# Altium schematic sheet Fan_Driver.SchDoc: Fan_Driver
size A4; Author: Thomas Carrington; DocumentNumber: 4; Revision: 2.1; SheetNumber: 4; SheetTotal: 8
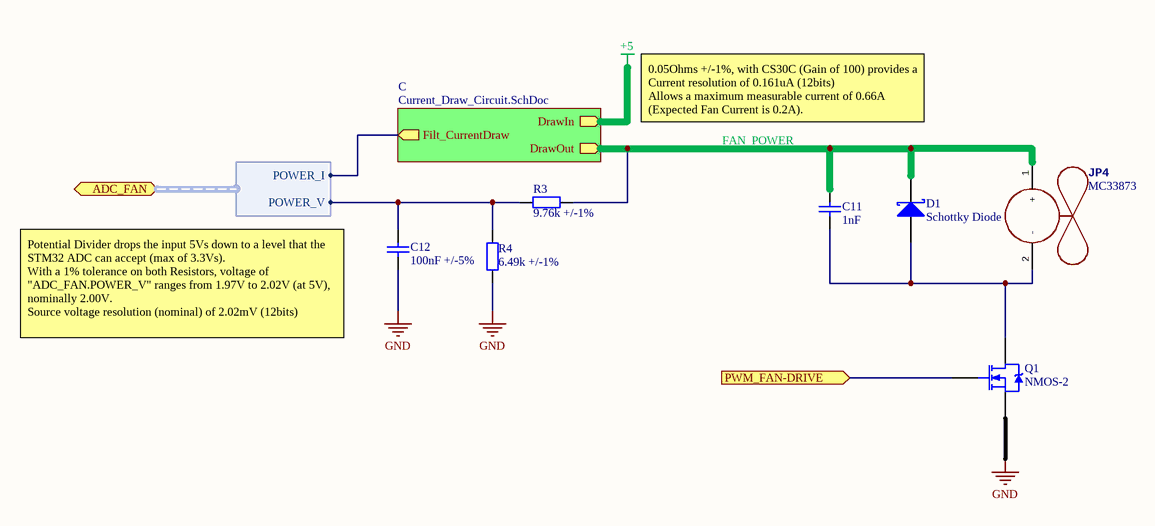
[diagram p0: Fan_Driver.SchDoc]

## Parts
C11  value 1nF  [CAPC1608X06N (0603)]  (hidden comment: Cap Semi)
C12  value 100nF +/-5%  [CAPC1608X06N (0603)]  (hidden comment: Cap Semi)
D1  Schottky Diode  [SODFL350X115-2N]
JP4  MC33873  [JP1Y]
Q1  NMOS-2  [SOT230P700X180-4N]
R3  value 9.76k +/-1%  [RESC1608X06N (0603)]  (hidden comment: Res)
R4  value 6.49k +/-1%  [RESC1608X06N (0603)]  (hidden comment: Res)

## Sub-sheets
C = Current_Draw_Circuit.SchDoc: Filt_CurrentDraw (out), DrawIn, DrawOut

## Ports
ADC_FAN (harness ADC_FAN), PWM_FAN-DRIVE (in)

## Harnesses
ADC_FAN: POWER_I, POWER_V

## Nets
+5: sheet C/DrawIn
GND: C12.1 Q1.3(S) R4.1
FAN_POWER: C11.2 D1.1(K) JP4.1(+) R3.2 ; sheet C/DrawOut
PWM_FAN-DRIVE: Q1.1(G) ; port PWM_FAN-DRIVE
NetC11_1: C11.1 D1.2(A) JP4.2(-) Q1.2(D)
NetC12_2: C12.2 R3.1 R4.2 ; port ADC_FAN.POWER_V
(unnamed): sheet C/Filt_CurrentDraw, port ADC_FAN.POWER_I

## Notes on the sheet
- 0.05Ohms +/-1%, with CS30C (Gain of 100) provides a Current resolution of 0.161uA (12bits)
  Allows a maximum measurable current of 0.66A (Expected Fan Current is 0.2A).
- Potential Divider drops the input 5Vs down to a level that the STM32 ADC can accept (max of 3.3Vs).
  With a 1% tolerance on both Resistors, voltage of "ADC_FAN.POWER_V" ranges from 1.97V to 2.02V (at 5V), nominally 2.00V.
  Source voltage resolution (nominal) of 2.02mV (12bits)
- Title
- Size:
- Date:
- A4
- Number:
- Time:
- Revision:
- Sheet
- of
- File:

## Library data of the parts
C11 C12 = Cap Semi: Capacitor (Semiconductor SIM Model); Published: 8-Jun-2000; LatestRevisionDate: 29-May-2009; LatestRevisionNote: IPC-7351 Footprint Added.; PackageReference: X7R; Publisher: Altium Limited; PackageDescription: Chip Capacitor
D1 = Diode: Schottky Rectifier; Note: Terminal 2 is the TAB and is electrically connected to the cathode; Published: 8-Jun-2000; LatestRevisionDate: 17-Jul-2002; LatestRevisionNote: Re-released for DXP Platform.; DatasheetVersion: PD-2.057B; PackageVersion: Feb-1998; PackageReference: TO-220AC; Publisher: Altium Limited; PackageDescription: TO, Thru-Hole, Vertical, Heatsink Mounted; 3 In-Line Leads (1 Absent); Pitch 2.54 mm; ComponentLink1Description: Manufacturer Link; ComponentLink1URL: http://www.irf.com/; ComponentLink2Description: Datasheet; ComponentLink2URL: http://www.irf.com/product-info/datasheets/data/10tq.pdf
JP4 = MC33873: Motor; Header Datasheet: https://uk.farnell.com/multicomp/mc34745/header-1-row-r-angle-2way/dp/1593426?st=2.54mm%20headere
Q1 = NMOS-2: N-Channel Power MOSFET; Note: Pin 2 is electrically connected to pin 4.; Published: 8-Jun-2000; LatestRevisionDate: 17-Jul-2002; LatestRevisionNote: Re-released for DXP Platform.; DatasheetVersion: PD-9.814; PackageVersion: Feb-1997; PackageReference: TO-220AB; Publisher: Altium Limited; PackageDescription: TO, Thru-Hole, Vertical, Heatsink Mounted; 3 In-Line Leads; Pitch 2.54 mm; ComponentLink1Description: Manufacturer Link; ComponentLink1URL: http://www.irf.com/
R3 R4 = Res: Resistor; Published: 8-Jun-2000; LatestRevisionDate: 17-Jul-2002; LatestRevisionNote: Re-released for DXP Platform.; PackageReference: MCWR06; Publisher: Altium Limited; PackageDescription: SMD Chip Resistor